# Altium schematic sheet Supplies.SchDoc
size A3; DocumentNumber: 1; SheetNumber: 1; SheetTotal: 9; PageSetup: Record=PageOptions|CenterHorizontal=True|CenterVertical=True|PrintScale=0.97|XCorrection=1.00|YCorrection=1.00|PrintKind=1|BorderSize=5000000|LeftOffset=0|BottomOffset=0|Orientation=2|PaperLength=2970|PaperWidth=2100|Scale=100|PaperSource=7|PrintQuality=600|MediaType=1|DitherType=10|PaperKind=A4|PrintScaleMode=1
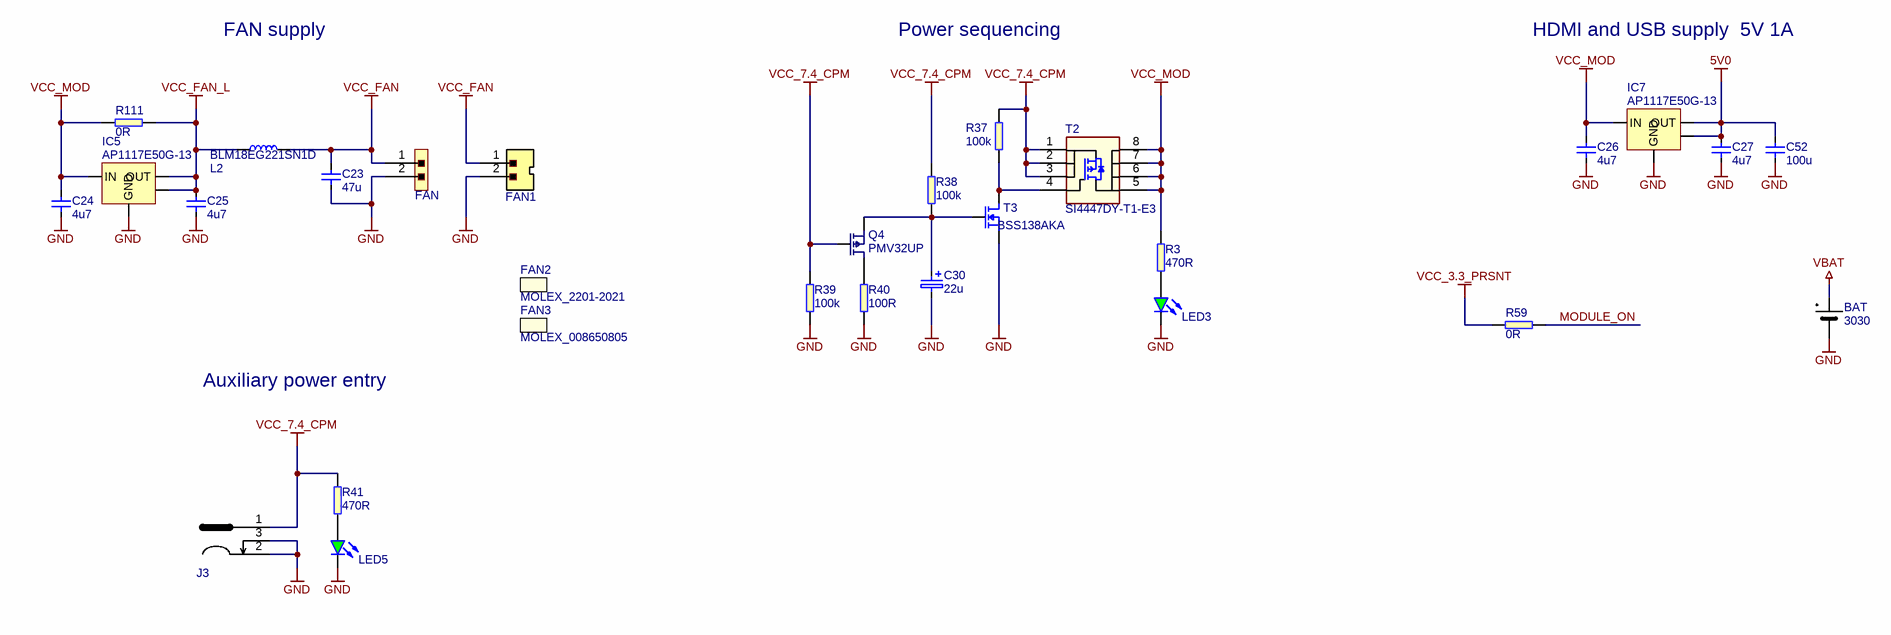
[diagram p0: Supplies.SchDoc]

## Parts
BAT  3030  [KEYSTONE_CR1025]
C23  47u  [1206]
C24  4u7  [0603]
C25  4u7  [0603]
C26  4u7  [0603]
C27  4u7  [0603]
C30  value 22u  [KEMET_C]
C52  100u  [0805]
FAN  *  [HEADER_1X2_male 2.54mm Angle]  (value not drawn)
FAN1  MX-22-23-2021  [molex_2223-2021]  (value not drawn)
FAN2  MOLEX_2201-2021  (no BOM)
FAN3  MOLEX_008650805  (no BOM)
IC5  AP1117E50G-13  [SOT223]
IC7  AP1117E50G-13  [SOT223]
J3  694106106102  [694106106102]  (value not drawn)
L2  BLM18EG221SN1D  [0603]
LED3  KPT-1608SGC  [LED0603]  (value not drawn)
LED5  KPT-1608SGC  [LED0603]  (value not drawn)
Q4  PMV32UP  [SOT-23]
R3  470R  [0603]
R37  100k  [0603]
R38  100k  [0603]
R39  100k  [0603]
R40  100R  [0603]
R41  470R  [0603]
R59  0R  [0603]
R111  0R  [0603]
T2  SI4447DY-T1-E3  [SOIC-SN8_M]
T3  BSS138AKA  [SOT-23]

## Nets
5V0: C27.2 C52.2 IC7.2(OUT) IC7.4(OUT)
GND: BAT.- C23.1 C24.1 C25.1 C26.1 C27.1 C30.2 C52.1 FAN.2 FAN1.2 IC5.1(GND) IC7.1(GND) J3.2 J3.3 LED3.K LED5.K R39.1 R40.1 T3.2(S)
VBAT: BAT.+
VCC_3.3_PRSNT: R59.1
VCC_7.4_CPM: J3.1 Q4.1(G) R37.2 R38.2 R39.2 R41.2 T2.1 T2.2 T2.3
VCC_FAN: C23.2 FAN.1 FAN1.1 L2.2
VCC_FAN_L: C25.2 IC5.2(OUT) IC5.4(OUT) L2.1 R111.2
VCC_MOD: C24.2 C26.2 IC5.3(IN) IC7.3(IN) R3.2 R111.1 T2.5 T2.6 T2.7 T2.8
MODULE_ON: R59.2
NetC30_1: C30.1 Q4.2(S) R38.1 T3.1(G)
NetLED3_A: LED3.A R3.1
NetLED5_A: LED5.A R41.1
NetQ4_3: Q4.3(D) R40.2
NetR37_1: R37.1 T2.4 T3.3(D)

## Notes on the sheet
- FAN supply
- Power sequencing
- HDMI and USB supply  5V 1A
- Auxiliary power entry
- Title:
- Size:
- Date:
- A3
- Revision:
- Page:
- of
- Antmicro Ltd.
- File:
- www.antmicro.com

## Library data of the parts
BAT = Keystone_CR1025: SMT holder for  CR1025 battery; Value: 3030; Manufacturer: Keystone; Part Number: Keystone_CR1025; MPN: 3030
C23 = C_47u_1206: MLCC SMT Capacitor 47uF 1206; Manufacturer: MURATA; MPN: GRM31CC80J476KE18L; Value: 47u; Part Number: C_47u_1206
C24-C27 = C_4u7_0603: MLCC SMT Capacitor 4u7F 0603; Manufacturer: MULTICOMP; MPN: MC0603X475K6R3CT; Value: 4u7; Part Number: C_4u7_0603
C30 = C_22u_KEMET_C: Tantalum SMT Capacitor 22uF Case KEMET_C; Manufacturer: KEMET; MPN: T491C226K025AT; Part Number: C_22u_KEMET_C
C52 = C_100u_0805: MLCC SMT Capacitor 100uF 0805; Manufacturer: MURATA; MPN: GRM21BR60J107ME15L; Part Number: C_100u_0805; Value: 100u
FAN = HEADER_1X2_male_angle: 1x2 pinhead male angle; Part Number: HEADER_1X2_male_angle
FAN1 = molex_2223-2021: Pinhead connector with key; Manufacturer: Molex; MPN: 022232021 A-6373-02A222; Part Number: molex_2223-2021; Value: MX-22-23-2021
FAN2 = MOLEX_2201-2021: KK 254 Crimp Housing 2 circuits; Manufacturer: MOLEX; Part Number: MOLEX_2201-2021; Value: MOLEX_2201-2021; MPN: MOLEX_2201-2021
FAN3 = MOLEX_008650805: conn term female 22-30 awg tin; Manufacturer: MOLEX; Part Number: MOLEX_008650805; Value: MOLEX_008650805; MPN: MOLEX_008650805
IC5 IC7 = AP1117E50G-13: LDO, 2V/5.5V, 1A, 5V,  SOT223; Manufacturer: Diodes; Value: AP1117E50G-13; Part Number: AP1117E50G-13; MPN: AP1117E50G-13
J3 = WE-694106106102: DC Power Jack Right Angled SMT Ø6.4 with 4 soldering pads & pegs WR-DC; Manufacturer: WURTH ELEKTRONIK; Part Number: WE-694106106102; Value: 694106106102; MPN: 694106106102
L2 = BLM18EG221SN1D: MURATA 	BLM18EG221SN1D  FERRITE BEAD, 0.05OHM, 2A, 0603; Part Number: BLM18EG221SN1D; Value: BLM18EG221SN1D; Manufacturer: MURATA; MPN: BLM18EG221SN1D
LED3 LED5 = LED_G: LED Green 0603 case; Part Number: LED_G; Manufacturer: KINGBRIGHT; Value: KPT-1608SGC; MPN: KPT-1608SGC
Q4 = PMV32UP: P CH, 20V, 4A; Manufacturer: NXP; Part Number: PMV32UP; Value: PMV32UP; MPN: PMV32UP
R3 R41 = R_470R_0603: SMT Resistor 470R 0603; Manufacturer: BOURNS; MPN: CR0603-JW-471GLF; Value: 470R; Part Number: R_470R_0603
R37-R39 = R_100k_0603: SMT Resistor 100k 0603; Manufacturer: BOURNS; MPN: CR0603-JW-104GLF; Value: 100k; Part Number: R_100k_0603
R40 = R_100R_0603: SMT Resistor 100R 0603; Manufacturer: MULTICOMP; MPN: MC0063W06035100R; Value: 100R; Part Number: R_100R_0603
R59 R111 = R_0R_0603: SMT Resistor 0R 0603; Manufacturer: BOURNS; MPN: CR0603-J/-000ELF; Value: 0R; Part Number: R_0R_0603
T2 = SI4447DY-T1-E3: p-channel MOSFET, SI4447DY-T1-E3; Manufacturer: VISHAY; Part Number: SI4447DY-T1-E3; Value: SI4447DY-T1-E3; MPN: SI4447DY-T1-E3
T3 = BSS138: MOSFET, N CH, 60V, 0.2A; Part Number: BSS138; Manufacturer: NXP; Value: BSS138AKA; MPN: BSS138AKA